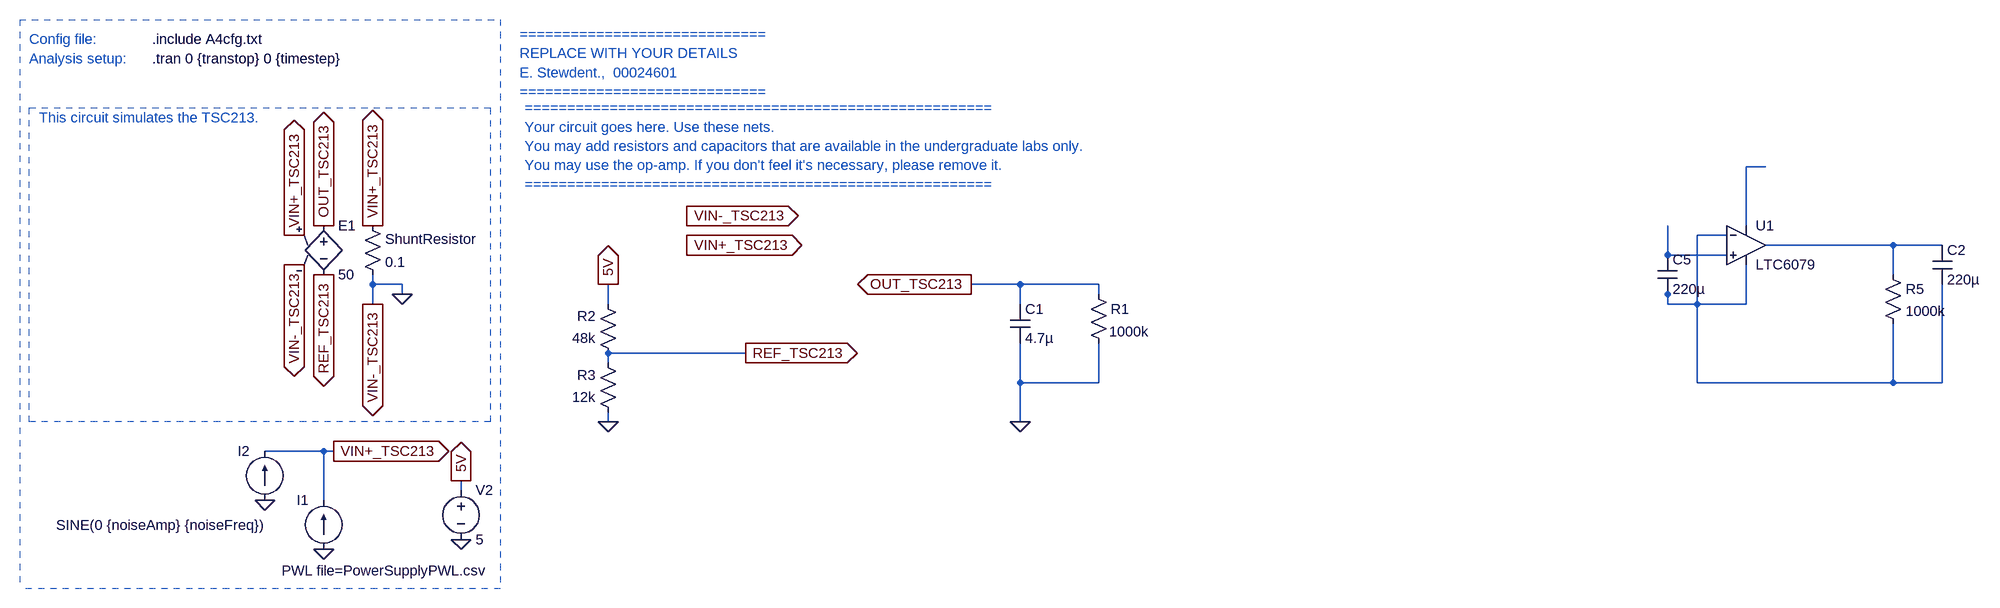
[diagram p0: schematic E344_22897828_A4.asc]
E344_22897828_A4.asc, the LTspice schematic file:
Version 4
SHEET 1 1824 680
WIRE 480 -1184 448 -1184
WIRE 448 -1088 448 -1184
WIRE 416 -1072 368 -1072
WIRE 688 -1056 480 -1056
WIRE 768 -1056 688 -1056
WIRE 320 -1040 320 -1088
WIRE 416 -1040 320 -1040
WIRE 688 -1008 688 -1056
WIRE -1792 -992 -1792 -1008
WIRE -1744 -992 -1792 -992
WIRE -736 -992 -816 -992
WIRE -608 -992 -736 -992
WIRE -1744 -976 -1744 -992
WIRE -608 -976 -608 -992
WIRE 320 -976 320 -992
WIRE -1792 -960 -1792 -992
WIRE -1408 -960 -1408 -992
WIRE -736 -960 -736 -992
WIRE 320 -960 320 -976
WIRE 368 -960 368 -1072
WIRE 368 -960 320 -960
WIRE 448 -960 448 -1024
WIRE 448 -960 368 -960
WIRE -1184 -880 -1408 -880
WIRE -1408 -864 -1408 -880
WIRE -736 -832 -736 -896
WIRE -608 -832 -608 -896
WIRE -608 -832 -736 -832
WIRE 368 -832 368 -960
WIRE 688 -832 688 -928
WIRE 688 -832 368 -832
WIRE 768 -832 768 -992
WIRE 768 -832 688 -832
WIRE -1408 -768 -1408 -784
WIRE -736 -768 -736 -832
WIRE -1872 -720 -1968 -720
WIRE -1856 -720 -1872 -720
WIRE -1648 -656 -1648 -672
WIRE -1872 -640 -1872 -720
FLAG -1648 -672 5V
IOPIN -1648 -672 Out
FLAG -1648 -576 0
FLAG -816 -992 OUT_TSC213
IOPIN -816 -992 Out
FLAG -1280 -1104 VIN-_TSC213
IOPIN -1280 -1104 Out
FLAG -1280 -1056 VIN+_TSC213
IOPIN -1280 -1056 Out
FLAG -1872 -560 0
FLAG -1792 -1088 VIN+_TSC213
IOPIN -1792 -1088 Out
FLAG -1792 -960 VIN-_TSC213
IOPIN -1792 -960 Out
FLAG -1920 -1024 VIN-_TSC213
IOPIN -1920 -1024 Out
FLAG -1920 -1072 VIN+_TSC213
IOPIN -1920 -1072 Out
FLAG -1872 -1008 REF_TSC213
IOPIN -1872 -1008 Out
FLAG -1872 -1088 OUT_TSC213
IOPIN -1872 -1088 Out
FLAG -1856 -720 VIN+_TSC213
IOPIN -1856 -720 Out
FLAG -1968 -640 0
FLAG -1408 -992 5V
IOPIN -1408 -992 Out
FLAG -1744 -976 0
FLAG -1184 -880 REF_TSC213
IOPIN -1184 -880 Out
FLAG -736 -768 0
FLAG -1408 -768 0
SYMBOL e -1872 -1104 R0
SYMATTR InstName E1
SYMATTR Value 50
SYMBOL current -1872 -560 R180
WINDOW 0 24 80 Left 2
WINDOW 3 -271 -35 Left 2
WINDOW 123 0 0 Left 0
WINDOW 39 0 0 Left 0
SYMATTR InstName I1
SYMATTR Value PWL file=PowerSupplyPWL.csv
SYMBOL res -1808 -1104 R0
WINDOW 0 36 38 Left 2
SYMATTR InstName ShuntResistor
SYMATTR Value 0.1
SYMBOL voltage -1648 -672 R0
WINDOW 123 0 0 Left 0
WINDOW 39 0 0 Left 0
SYMATTR InstName V2
SYMATTR Value 5
SYMBOL current -1968 -640 R180
WINDOW 0 24 80 Left 2
WINDOW 3 -7 -41 Left 2
WINDOW 123 0 0 Left 0
WINDOW 39 0 0 Left 0
SYMATTR InstName I2
SYMATTR Value SINE(0 {noiseAmp} {noiseFreq})
SYMBOL OpAmps\\LTC6079 448 -1056 R0
SYMATTR InstName U1
SYMBOL cap -752 -960 R0
SYMATTR InstName C1
SYMATTR Value 4.7µ
SYMBOL res -624 -992 R0
WINDOW 3 33 77 Left 2
SYMATTR InstName R1
SYMATTR Value 1000k
SYMBOL res -1392 -864 R180
WINDOW 0 36 76 Left 2
WINDOW 3 36 40 Left 2
SYMATTR InstName R2
SYMATTR Value 48k
SYMBOL res -1392 -768 R180
WINDOW 0 36 76 Left 2
WINDOW 3 36 40 Left 2
SYMATTR InstName R3
SYMATTR Value 12k
SYMBOL cap 304 -1040 R0
SYMATTR InstName C5
SYMATTR Value 220µ
SYMBOL cap 752 -1056 R0
SYMATTR InstName C2
SYMATTR Value 220µ
SYMBOL res 672 -1024 R0
SYMATTR InstName R5
SYMATTR Value 1000k
TEXT -2152 -1360 Left 2 !.tran 0 {transtop} 0 {timestep}
TEXT -2152 -1392 Left 2 !.include A4cfg.txt
TEXT -2352 -1392 Left 2 ;Config file:
TEXT -2352 -1360 Left 2 ;Analysis setup:
TEXT -1552 -1400 Left 2 ;=============================\nREPLACE WITH YOUR DETAILS\nE. Stewdent.,  00024601\n=============================
TEXT -1544 -1280 Left 2 ;=======================================================\nYour circuit goes here. Use these nets.\nYou may add resistors and capacitors that are available in the undergraduate labs only.\nYou may use the op-amp. If you don't feel it's necessary, please remove it.\n=======================================================
TEXT -2336 -1264 Left 2 ;This circuit simulates the TSC213.
LINE Normal -1584 -1424 -1584 -496 2
LINE Normal -2368 -1424 -1584 -1424 2
LINE Normal -1584 -496 -2368 -496 2
LINE Normal -1584 -512 -1584 -512 2
LINE Normal -2368 -1424 -2368 -496 2
RECTANGLE Normal -2352 -1280 -1600 -768 2

The netlist it stands for:
* E344_22897828_A4.asc
E1 OUT_TSC213 REF_TSC213 VIN+_TSC213 0 50
I1 0 VIN+_TSC213 PWL file=PowerSupplyPWL.csv
R§ShuntResistor VIN+_TSC213 0 0.1
V2 5V 0 5
I2 0 VIN+_TSC213 SINE(0 {noiseAmp} {noiseFreq})
XU1 N004 N002 N001 N002 N003 LTC6078  ; LTC6079, pins In+ In- V+ V- OUT
C1 OUT_TSC213 0 4.7µ
R1 OUT_TSC213 0 1000k
R2 REF_TSC213 5V 48k
R3 0 REF_TSC213 12k
C5 N004 N002 220µ
C2 N003 N002 220µ
R5 N003 N002 1000k
.tran 0 {transtop} 0 {timestep}
.include A4cfg.txt
* Config file:
* Analysis setup:
* =============================
* REPLACE WITH YOUR DETAILS
* E. Stewdent.,  00024601
* =============================
* =======================================================
* Your circuit goes here. Use these nets.
* You may add resistors and capacitors that are available in the undergraduate labs only.
* You may use the op-amp. If you don't feel it's necessary, please remove it.
* =======================================================
* This circuit simulates the TSC213.
.lib LTC5.lib
.backanno
.end

* Results of the author's LTspice run, read from the files saved beside the schematic
* Operating Point, zero values left out:
*   V(out_tsc213) = 990.5 mV
*   V(ref_tsc213) = 990.5 mV
*   V(5v) = 5 V
*   I(R3) = -82.54 µA
*   I(R2) = -83.53 µA
*   I(R1) = 990.5 nA
*   I(E1) = -990.5 nA
*   I(V2) = -83.53 µA
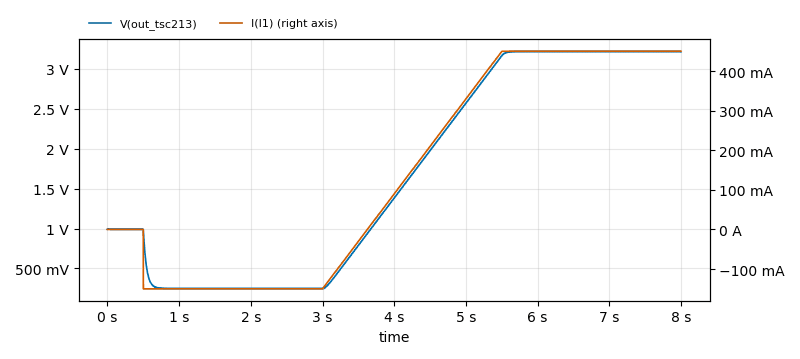
[diagram p1: Transient Analysis of E344_22897828_A4.asc, plotted from the saved traces]
* Transient Analysis, 1 run:
*   V(out_tsc213): min 244.1 mV, max 3.223 V, average 1.675 V, rms 2.105 V, last 3.216 V
*   I(I1): min -150 mA, max 450 mA, average 140.6 mA, rms 294.5 mA, last 450 mA